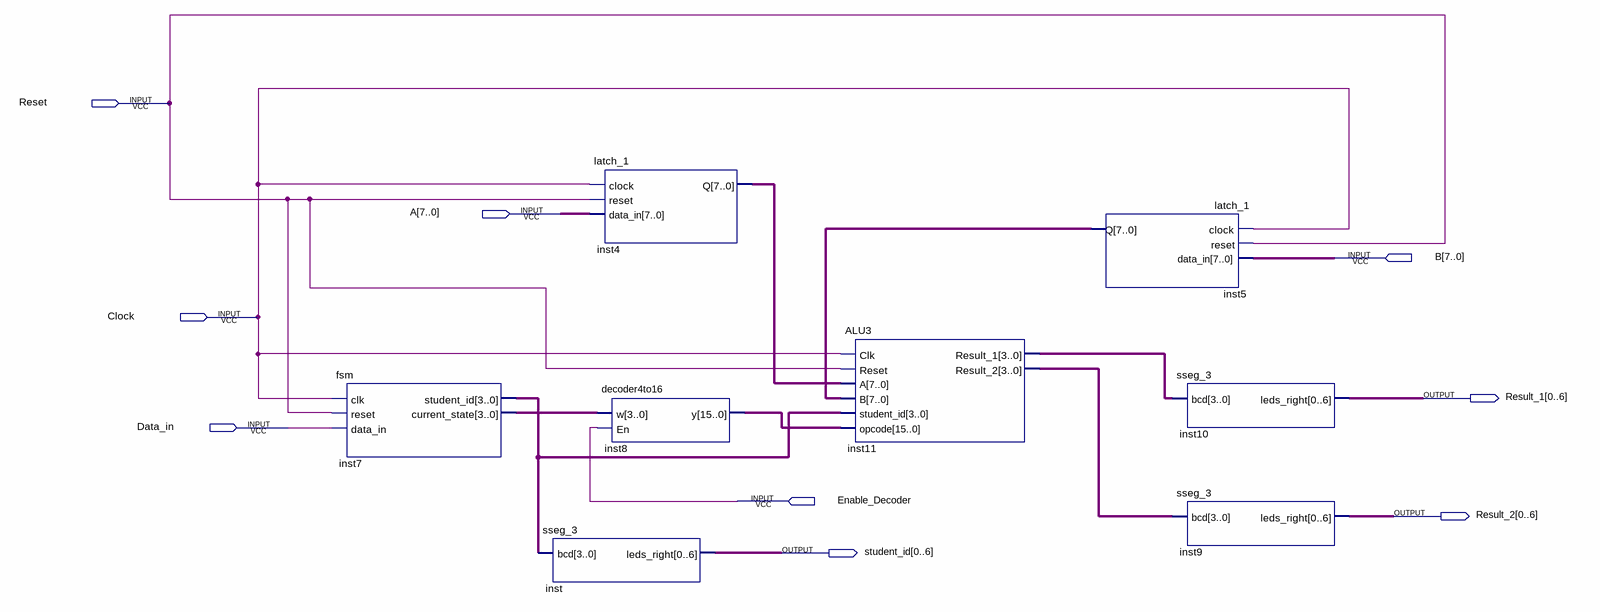
[diagram p0: schematic sheet]
// Quartus schematic ALUProblem3.bdf as structural Verilog: 8 symbols, 9 pins
module ALUProblem3 (
  input  Reset,
  input  [7:0] A,
  input  [7:0] B,
  input  Clock,
  input  Data_in,
  input  Enable_Decoder,
  output [0:6] Result_1,
  output [0:6] Result_2,
  output [0:6] student_id
);

  wire [3:0] inst7_current_state, inst7_student_id, inst11_result_1, inst11_result_2;
  wire [7:0] inst4_q, inst5_q;
  wire [15:0] inst8_y;

  fsm inst7 (
    .clk(Clock), .reset(Reset), .data_in(Data_in), .student_id(inst7_student_id),
    .current_state(inst7_current_state));
  sseg_3 inst (.bcd(inst7_student_id), .leds_right(student_id));
  latch_1 inst4 (.clock(Clock), .reset(Reset), .data_in(A), .Q(inst4_q));
  decoder4to16 inst8 (.w(inst7_current_state), .En(Enable_Decoder), .y(inst8_y));
  ALU3 inst11 (
    .Clk(Clock), .Reset(Reset), .A(inst4_q), .B(inst5_q), .student_id(inst7_student_id), .opcode(inst8_y),
    .Result_1(inst11_result_1), .Result_2(inst11_result_2));
  latch_1 inst5 (.clock(Clock), .reset(Reset), .data_in(B), .Q(inst5_q));
  sseg_3 inst10 (.bcd(inst11_result_1), .leds_right(Result_1));
  sseg_3 inst9 (.bcd(inst11_result_2), .leds_right(Result_2));
endmodule
